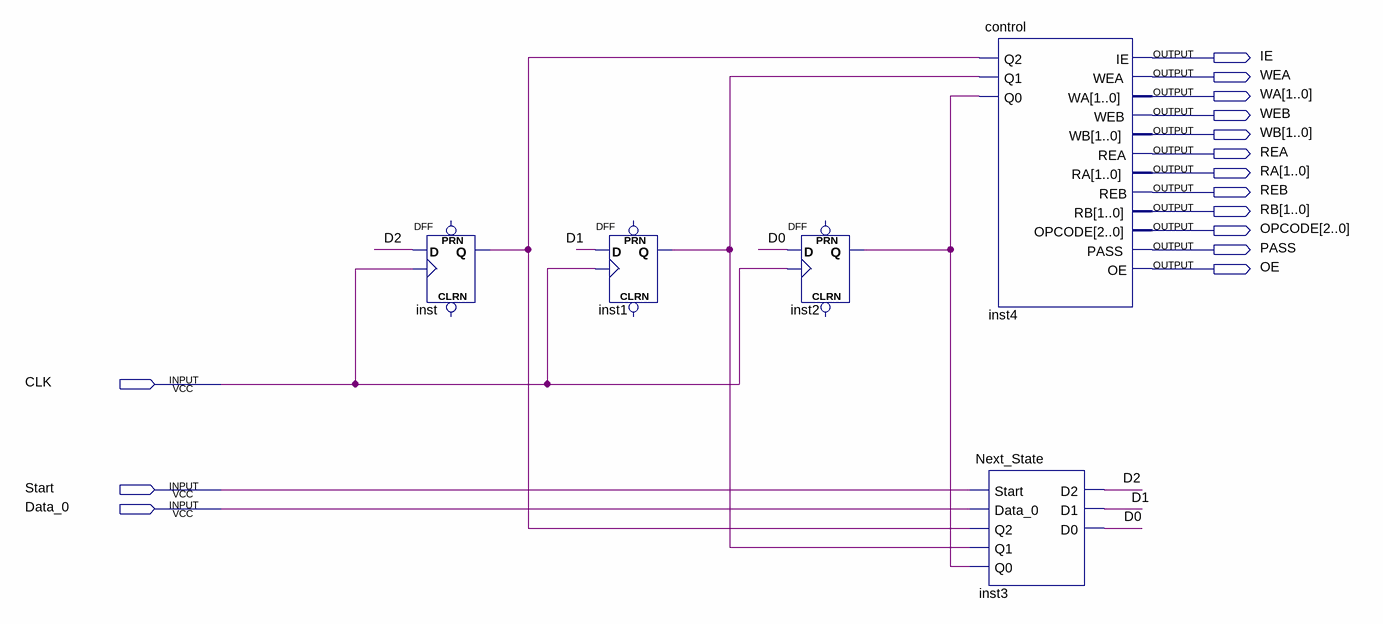
[diagram p0: schematic sheet]
// Quartus schematic controller.bdf as structural Verilog: 5 symbols, 15 pins
module controller (
  input  CLK,
  input  Start,
  input  Data_0,
  output IE,
  output WEA,
  output [1:0] WA,
  output WEB,
  output [1:0] WB,
  output REA,
  output [1:0] RA,
  output REB,
  output [1:0] RB,
  output [2:0] OPCODE,
  output PASS,
  output OE
);

  wire D0, D1, D2, inst1_q, inst2_q, inst_q;

  DFF inst (.CLK(CLK), .D(D2), .Q(inst_q));  // open: CLRN, PRN
  DFF inst1 (.CLK(CLK), .D(D1), .Q(inst1_q));  // open: CLRN, PRN
  DFF inst2 (.CLK(CLK), .D(D0), .Q(inst2_q));  // open: CLRN, PRN
  Next_State inst3 (.Start(Start), .Data_0(Data_0), .Q2(inst_q), .Q1(inst1_q), .Q0(inst2_q), .D2(D2), .D1(D1), .D0(D0));
  control inst4 (
    .Q2(inst_q), .Q1(inst1_q), .Q0(inst2_q), .IE(IE), .WEA(WEA), .WA(WA), .WEB(WEB), .WB(WB), .REA(REA),
    .RA(RA), .REB(REB), .RB(RB), .OPCODE(OPCODE), .PASS(PASS), .OE(OE));
endmodule
